# EAGLE design touringmach3 (EAGLE 9.5.0)
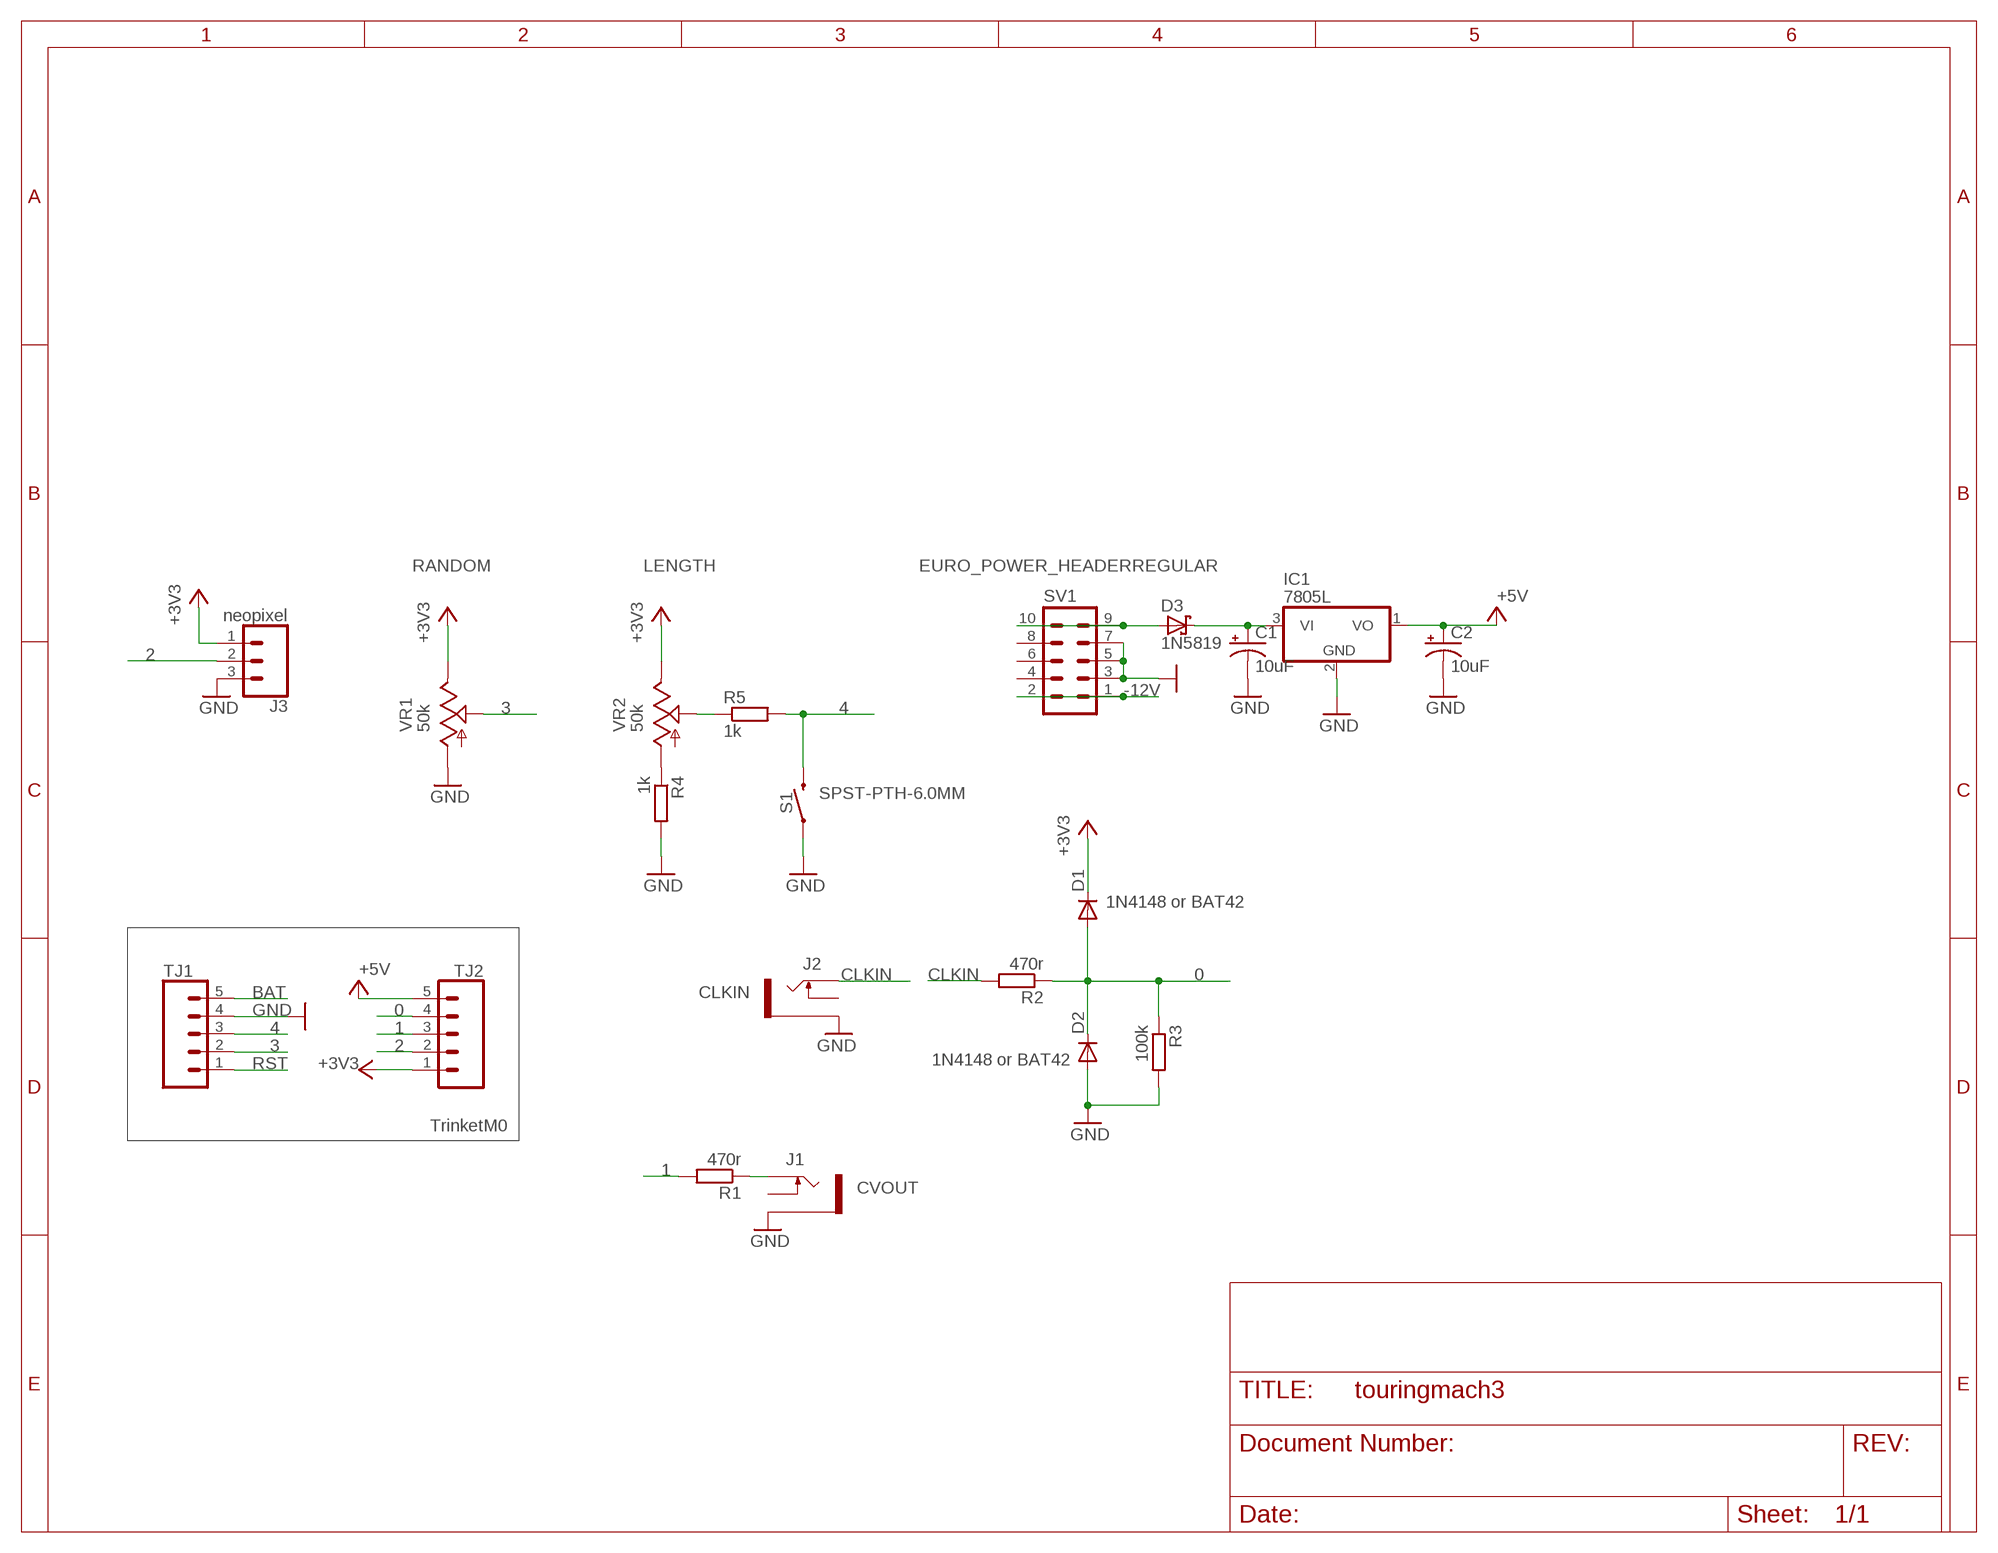
[diagram p0: schematic, sheet 1]

## Parts
C1  10uF  CPOL-USE2.5-6  [E2,5-6]
C2  10uF  CPOL-USE2.5-6  [E2,5-6]
D1  1N4148 or BAT42  BAT42  [DO34-7]
D2  1N4148 or BAT42  BAT42  [DO34-7]
D3  1N5819  1N5819-B  [DO41-7.6]
IC1  7805L  [TO92]
J1  THONKICONNOLD  [THONKICONN]
J2  THONKICONNOLD  [THONKICONN]
J3  neopixel  CONN_03  [1X03]
R1  470r  RESISTOR7MM  [7MM_RESISTOR]
R2  470r  RESISTOR7MM  [7MM_RESISTOR]
R3  100k  RESISTOR7MM  [7MM_RESISTOR]
R4  1k  RESISTOR7MM  [7MM_RESISTOR]
R5  1k  RESISTOR7MM  [7MM_RESISTOR]
S1  SPST-PTH-6.0MM  MOMENTARY-SWITCH-SPST-PTH-6.0MM  [TACTILE_SWITCH_PTH_6.0MM]
SV1  EURO_POWER_HEADERREGULAR  [EURO_POWER_HEADER]
TJ1  CONN_05  [1X05]
TJ2  CONN_05  [1X05]
VR1  50k  9MM_SNAP-IN_POT_  [9MM_SNAP-IN_POT]
VR2  50k  9MM_SNAP-IN_POT_  [9MM_SNAP-IN_POT]

## Nets
0: D1.A D2.C R2.1 R3.1 TJ2.4
1: R1.2 TJ2.3
2: J3.2 TJ2.2
3: TJ1.2 VR1.2(S)
4: R5.2 S1.3 TJ1.3
+3V3: D1.C J3.1 TJ2.1 VR1.3(E) VR2.3(E)
+5V: C2.+ IC1.1(VO) TJ2.5
-12V: SV1.1 SV1.2
BAT: TJ1.5
CLKIN: J2.P$3_TIP(TIP) R2.2
GND: C1.- C2.- D2.A IC1.2(GND) J1.P$1_SLEEVE(SLEEVE) J2.P$1_SLEEVE(SLEEVE) J3.3 R3.2 R4.2 S1.1 SV1.3 SV1.5 SV1.7 TJ1.4 VR1.1(A)
N$1: J1.P$3_TIP(TIP) R1.1
N$2: C1.+ D3.C IC1.3(VI)
N$3: D3.A SV1.9 SV1.10
N$4: R4.1 VR2.1(A)
N$5: R5.1 VR2.2(S)
RST: TJ1.1
Unconnected: J1.P$2_SWITCH(SWITCH) J2.P$2_SWITCH(SWITCH) SV1.4 SV1.6 SV1.8

## Notes on the sheet
- RANDOM | LENGTH
- CLKIN
- TrinketM0
- CVOUT

## Library data of the parts
C1 C2 = rcl:CPOL-US: POLARIZED CAPACITOR, American symbol; SPICEPREFIX: C
D1 D2 = radiomusic:BAT42
D3 = diode:1N581*: 1.0A SCHOTTKY BARRIER RECTIFIER Source: http://www.diodes.com/datasheets/ds23001.pdf
IC1 = linear:78*: Positive VOLTAGE REGULATOR Source: http://cache.national.com/ds/LM/LM78L05.pdf http://www.fairchildsemi.com/ds/LM/LM7805.pdf
J1 J2 = MusicThingModular:THONKICONN: 3.5mm socket for Eurorack modular synths
J3 = SparkFun-Connectors:CONN_03: Multi connection point. Often used as Generic Header-pin footprint for 0.1 inch spaced/style header connections On any of the 0.1 inch spaced packages, you can populate with these: Break Away Headers - Straight <https://www.sparkfun.com/products/116> (PRT-00116) Break Away Male Headers - Right Angle <https://www.sparkfun.com/products/553> (PRT-00553) Female Headers <https://www.sparkfun.com/products/115> (PRT-00115) Break Away Headers - Machine Pin <https://www.sparkfun.com/products/117> (PRT-00117) Break Away Female Headers - Swiss Machine Pin <https://www.sparkfun.com/products/743> (PRT-00743) Stackable Header - 3 Pin (Female, 0.1") <https://www.sparkfun.com/products/13875> (PRT-13875) For SCREWTERMINALS and SPRING TERMINALS visit here: Screw Terimnals on SparkFun.com <https://www.sparkfun.com/search/results?term=Screw+Terminals> (5mm/3.5mm/2.54mm spacing) This device is also useful as a general connection point to wire up your design to another part of your project. Our various solder wires solder well into these plated through hole pads. Hook-Up Wire - Assortment (Stranded, 22 AWG) <https://www.sparkfun.com/products/11375> (PRT-11375) Hook-Up Wire - Assortment (Solid Core, 22 AWG) <https://www.sparkfun.com/products/11367> (PRT-11367) View the entire wire category on our website here <https://www.sparkfun.com/categories/141> Special notes: Molex polarized connector foot print use with SKU : PRT-08232 with associated crimp pins and housings.
R1-R5 = MusicThingModular:RESISTOR: Standard resistor, various versions
S1 = SparkFun-Switches:MOMENTARY-SWITCH-SPST: Momentary Switch (Pushbutton) - SPST Normally-open (NO) SPST momentary switches (buttons, pushbuttons). Variants PTH-12MM - 12mm square, through-hole Momentary Pushbutton Switch - 12mm Square <https://www.sparkfun.com/products/9190> (COM-09190) PTH-6.0MM, PTH-6.0MM-KIT - 6.0mm square, through-hole Mini Pushbutton Switch <https://www.sparkfun.com/products/97> (COM-00097) KIT package intended for soldering kit's - only one side of pads' copper is exposed. PTH-RIGHT-ANGLE-KIT - Right-angle, through-hole Right Angle Tactile Button <https://www.sparkfun.com/products/10791> - Used on SparkFun BigTime Watch Kit <https://www.sparkfun.com/products/11734> SMD-12MM - 12mm square, surface-mount Tactile Button - SMD (12mm) <https://www.sparkfun.com/products/12993> (COM-12993) Used on SparkFun PicoBoard <https://www.sparkfun.com/products/11888> SMD-4.5MM - 4.5mm Square Trackball Switch Used on SparkFun Blackberry Trackballer Breakout <https://www.sparkfun.com/products/13169> SMD-4.6MMX2.8MM - 4.60mm x 2.80mm, surface mount Used on SparkFun SAMD21 Mini Breakout <https://www.sparkfun.com/products/13664> SMD-5.2MM, SMD-5.2-REDUNDANT - 5.2mm square, surface-mount Mini Pushbutton Switch - SMD <https://www.sparkfun.com/products/8720> (COM-08720) Used on Arduino Pro Mini <https://www.sparkfun.com/products/11114> REDUNDANT package connects both switch circuits together SMD-6.0X3.5MM - 6.0 x 3.5mm, surface mount Momentary Reset Switch SMD <https://www.sparkfun.com/products/8229> (COM-08229) SMD-6.2MM-TALL - 6.2mm square, surface mount Tactile Button - SMD (6mm) <https://www.sparkfun.com/products/12992> Used on SparkFun Digital Sandbox <https://www.sparkfun.com/products/12651> SMD-RIGHT-ANGLE - Right-angle, surface mount Used on SparkFun Block for Intel® Edison - Arduino <https://www.sparkfun.com/products/13036>; PROD_ID: SWCH-08441; SF_SKU: COM-00097
SV1 = MusicThingModular:EURO_POWER_HEADER: Power Header 10 pin power header for Eurorack Power Supplies Variants with fatter pads for easier soldering, and the LOCK variant which has 5mil offset pins to hold the component in place before soldering
TJ1 TJ2 = SparkFun-Connectors:CONN_05: Multi connection point. Often used as Generic Header-pin footprint for 0.1 inch spaced/style header connections On any of the 0.1 inch spaced packages, you can populate with these: Break Away Headers - Straight <https://www.sparkfun.com/products/116> (PRT-00116) Break Away Male Headers - Right Angle <https://www.sparkfun.com/products/553> (PRT-00553) Female Headers <https://www.sparkfun.com/products/115> (PRT-00115) Break Away Headers - Machine Pin <https://www.sparkfun.com/products/117> (PRT-00117) Break Away Female Headers - Swiss Machine Pin <https://www.sparkfun.com/products/743> (PRT-00743) For SCREWTERMINALS and SPRING TERMINALS visit here: Screw Terimnals on SparkFun.com <https://www.sparkfun.com/search/results?term=Screw+Terminals> (5mm/3.5mm/2.54mm spacing) This device is also useful as a general connection point to wire up your design to another part of your project. Our various solder wires solder well into these plated through hole pads. Hook-Up Wire - Assortment (Stranded, 22 AWG) <https://www.sparkfun.com/products/11375> (PRT-11375) Hook-Up Wire - Assortment (Solid Core, 22 AWG) <https://www.sparkfun.com/products/11367> (PRT-11367) View the entire wire category on our website here <https://www.sparkfun.com/categories/141> Special notes: Molex polarized connector foot print use with SKU : PRT-08231 with associated crimp pins and housings. 1MM SMD Version SKU: PRT-10208
VR1 VR2 = MusicThingModular:9MM_SNAP-IN_POT: 9mm vertical snap-in pot, Alpha / Panasonic style

## Net classes
1 power: width 0.406 mm
2 ground: width 0.457 mm

## Board
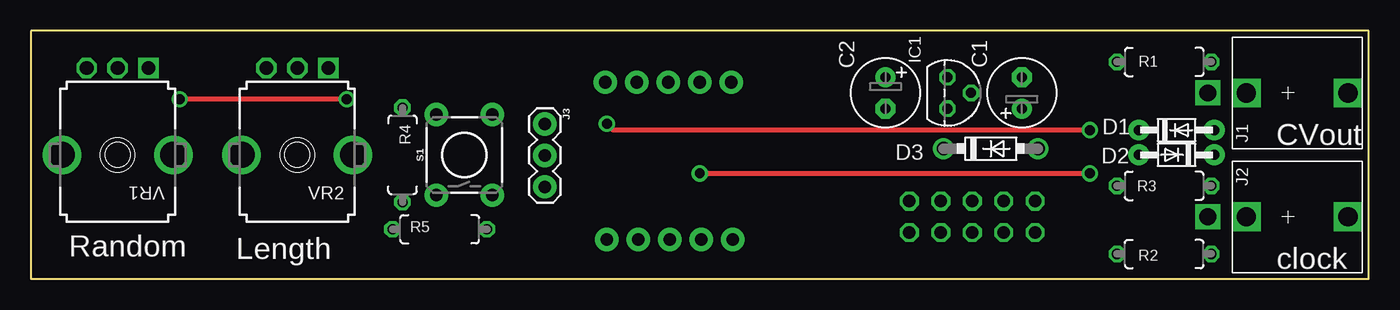
[diagram p1: board, top side]
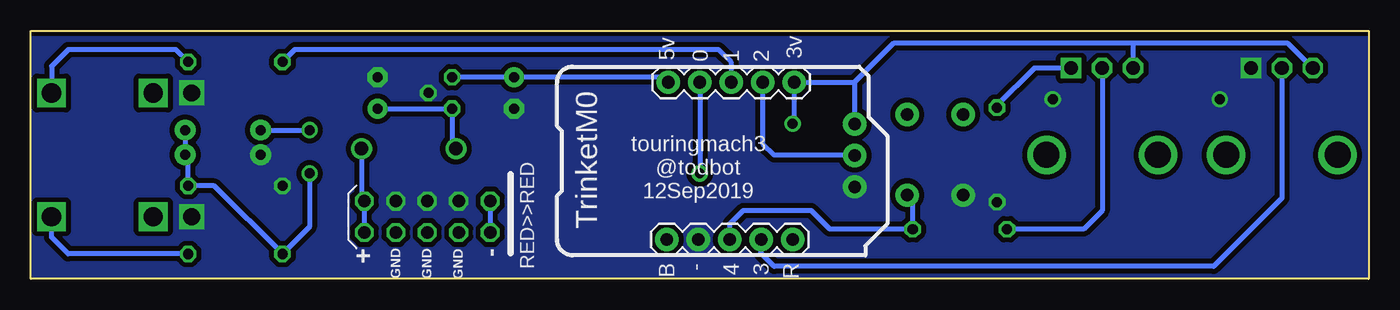
[diagram p2: board, bottom side, seen from below]

Size 108 x 20 mm. Coordinates in mm from the lower left corner, seen from the top.
Outline: 0,0 108,0 108,20 0,20 0,0
Copper layers (1*16): Top 0.035mm / dielectric 1.5mm / Bottom 0.035mm
Design rules "OthermillDRC_30_deg_v2": minimum track width 6mil, minimum drill 0.8mm, track to track 6mil, track to pad 6mil, pad to pad 6mil, via to via 6mil, smd to smd 0mil, copper to edge 0mil, drill to drill 6mil, minimum pad ring 10mil, minimum via ring 10mil, stop-mask expansion 1mil, vias tented up to drill 30mil, thermal gap 6mil

### Footprints (pad centres in the part's own frame; a part is rotated, then mirrored left to right if it is on the bottom)
E2,5-6 = drill 0.813 pad 1.6: + -1.27,0 | drill 0.813 pad 1.6 octagon: - 1.27,0
DO34-7 = drill 0.8 pad 1.676: A 3.04,0 | drill 0.813 pad 1.676: C -3.04,0
DO41-7.6 = drill 1.1 pad 1.7: A 3.81,0; C -3.81,0
TO92 = drill 0.813 octagon: 1 -1.27,0; 2 0,1.905; 3 1.27,0
THONKICONN = drill 1.35 square: P$1_SLEEVE 0,-6.48 | drill 1.55 square: P$2_SWITCH 0,-3.38; P$3_TIP 0,4.84
1X03 = drill 1.016 pad 1.88: 1 0,0; 2 2.54,0; 3 5.08,0
7MM_RESISTOR = drill 0.813 octagon: 1 -3.81,0; 2 3.81,0
TACTILE_SWITCH_PTH_6.0MM = drill 1.016 pad 1.88: 1 -3.251,2.261; 2 3.251,2.261; 3 -3.251,-2.261; 4 3.251,-2.261
EURO_POWER_HEADER = drill 1.016 octagon: 1 -5.08,-1.27; 2 -5.08,1.27; 3 -2.54,-1.27; 4 -2.54,1.27; 5 0,-1.27; 6 0,1.27; 7 2.54,-1.27; 8 2.54,1.27; 9 5.08,-1.27; 10 5.08,1.27
1X05 = drill 1.016 pad 1.88: 1 0,0; 2 2.54,0; 3 5.08,0; 4 7.62,0; 5 10.16,0
9MM_SNAP-IN_POT = drill 1.1 square: 1 -2.5,-7 | drill 1.1 octagon: 2 0,-7; 3 2.5,-7 | drill 2.1 pad 2.794: CHASSIS1 -4.5,0; CHASSIS2 4.5,0

### Placement (x,y rotation side)
C1  80,15 90 top
C2  69,15 270 top
D1  92.5,12 0 top
D2  92.5,10 180 top
D3  77.5,10.5 0 top
IC1  74,15 270 top
J1  101.5,15 270 top
J2  101.5,5 270 top
J3  41.5,12.5 270 top
R1  91.5,17.5 180 top
R2  91.5,2 0 top
R3  91.5,7.5 180 top
R4  30,10 270 top
R5  33,4 0 top
S1  35,10 90 top
SV1  76,5 180 bottom
TJ1  46.5,3.16 180 bottom
TJ2  46.38,15.86 180 bottom
VR1  7,10 180 top
VR2  21.5,10 180 top

### Tracks (layer width: path | path; a pad name or v marks a point on that pad's centre or on a via)
0  (via drill 0.8)
  Top 0.406: v54,8.5 v85.5,8.5
  Bottom 0.406: D1.A D2.C 95.31,9.77 R3.1 93.19,7.5 R2.1 85.5,4.19 v85.5,8.5 | v54,8.5 TJ2.4
1
  Bottom 0.406: TJ2.3 51.46,17.46 52.5,18.5 86.69,18.5 R1.2
2
  Bottom 0.406: TJ2.2 48.92,10.92 48,10 41.54,10 J3.2
3
  Bottom 0.406: TJ1.2 49.04,2.04 48,1 12.5,1 7,6.5 VR1.2
4
  Bottom 0.406: TJ1.3 51.58,4.42 50.5,5.5 45,5.5 43.5,4 R5.2 36.81,6.3 S1.3
+3V3  (via drill 0.8)
  Top 0.406: v46.5,12.5 47,12 v85.5,12
  Bottom 0.406: 41.5,15.86 TJ2.1 46.38,12.62 v46.5,12.5 | 41.5,15.86 J3.1 | VR1.3 6.5,19 19,19 | VR2.3 19,19 | D1.C v85.5,12 | 41.5,15.86 38.36,19 19,19
+5V
  Bottom 0.406: TJ2.5 56.95,16.27 C2.+ IC1.1
-12V
  Bottom 0.406: SV1.1 SV1.2
CLKIN
  Bottom 0.406: R2.2 105,2 106.34,3.34 J2.P$3_TIP
GND  (via drill 0.8)
  Top 0.406: v25.5,14.5 v12,14.5
  pour Bottom (isolate 0.406, no thermals): 0.1,19.5 108,19.5 108,0.1 0.1,0.1
N$1
  Bottom 0.406: R1.1 96.31,18.5 105,18.5 106.34,17.16 J1.P$3_TIP
N$2
  Bottom 0.406: D3.C 74,10.81 IC1.3 C1.+
N$3
  Bottom 0.406: SV1.10 SV1.9 81.31,6.5 D3.A
N$4
  Bottom 0.406: VR2.1 27,17 30,14 R4.1
N$5
  Bottom 0.406: VR2.2 21.5,5.5 23,4 R5.1

### Text on the board
tPlace: CVout | Random | Length | clock | Touring Machine
bPlace: 3v | 2 | 1 | 0 | 5v | touringmach3 / @todbot / 12Sep2019 | TrinketM0 | R | 3 | 4 | - | B
Reference: CUT OUT | CUT OUT